# EAGLE schematic Esquemático v2 v50 (EAGLE 9.7.0)
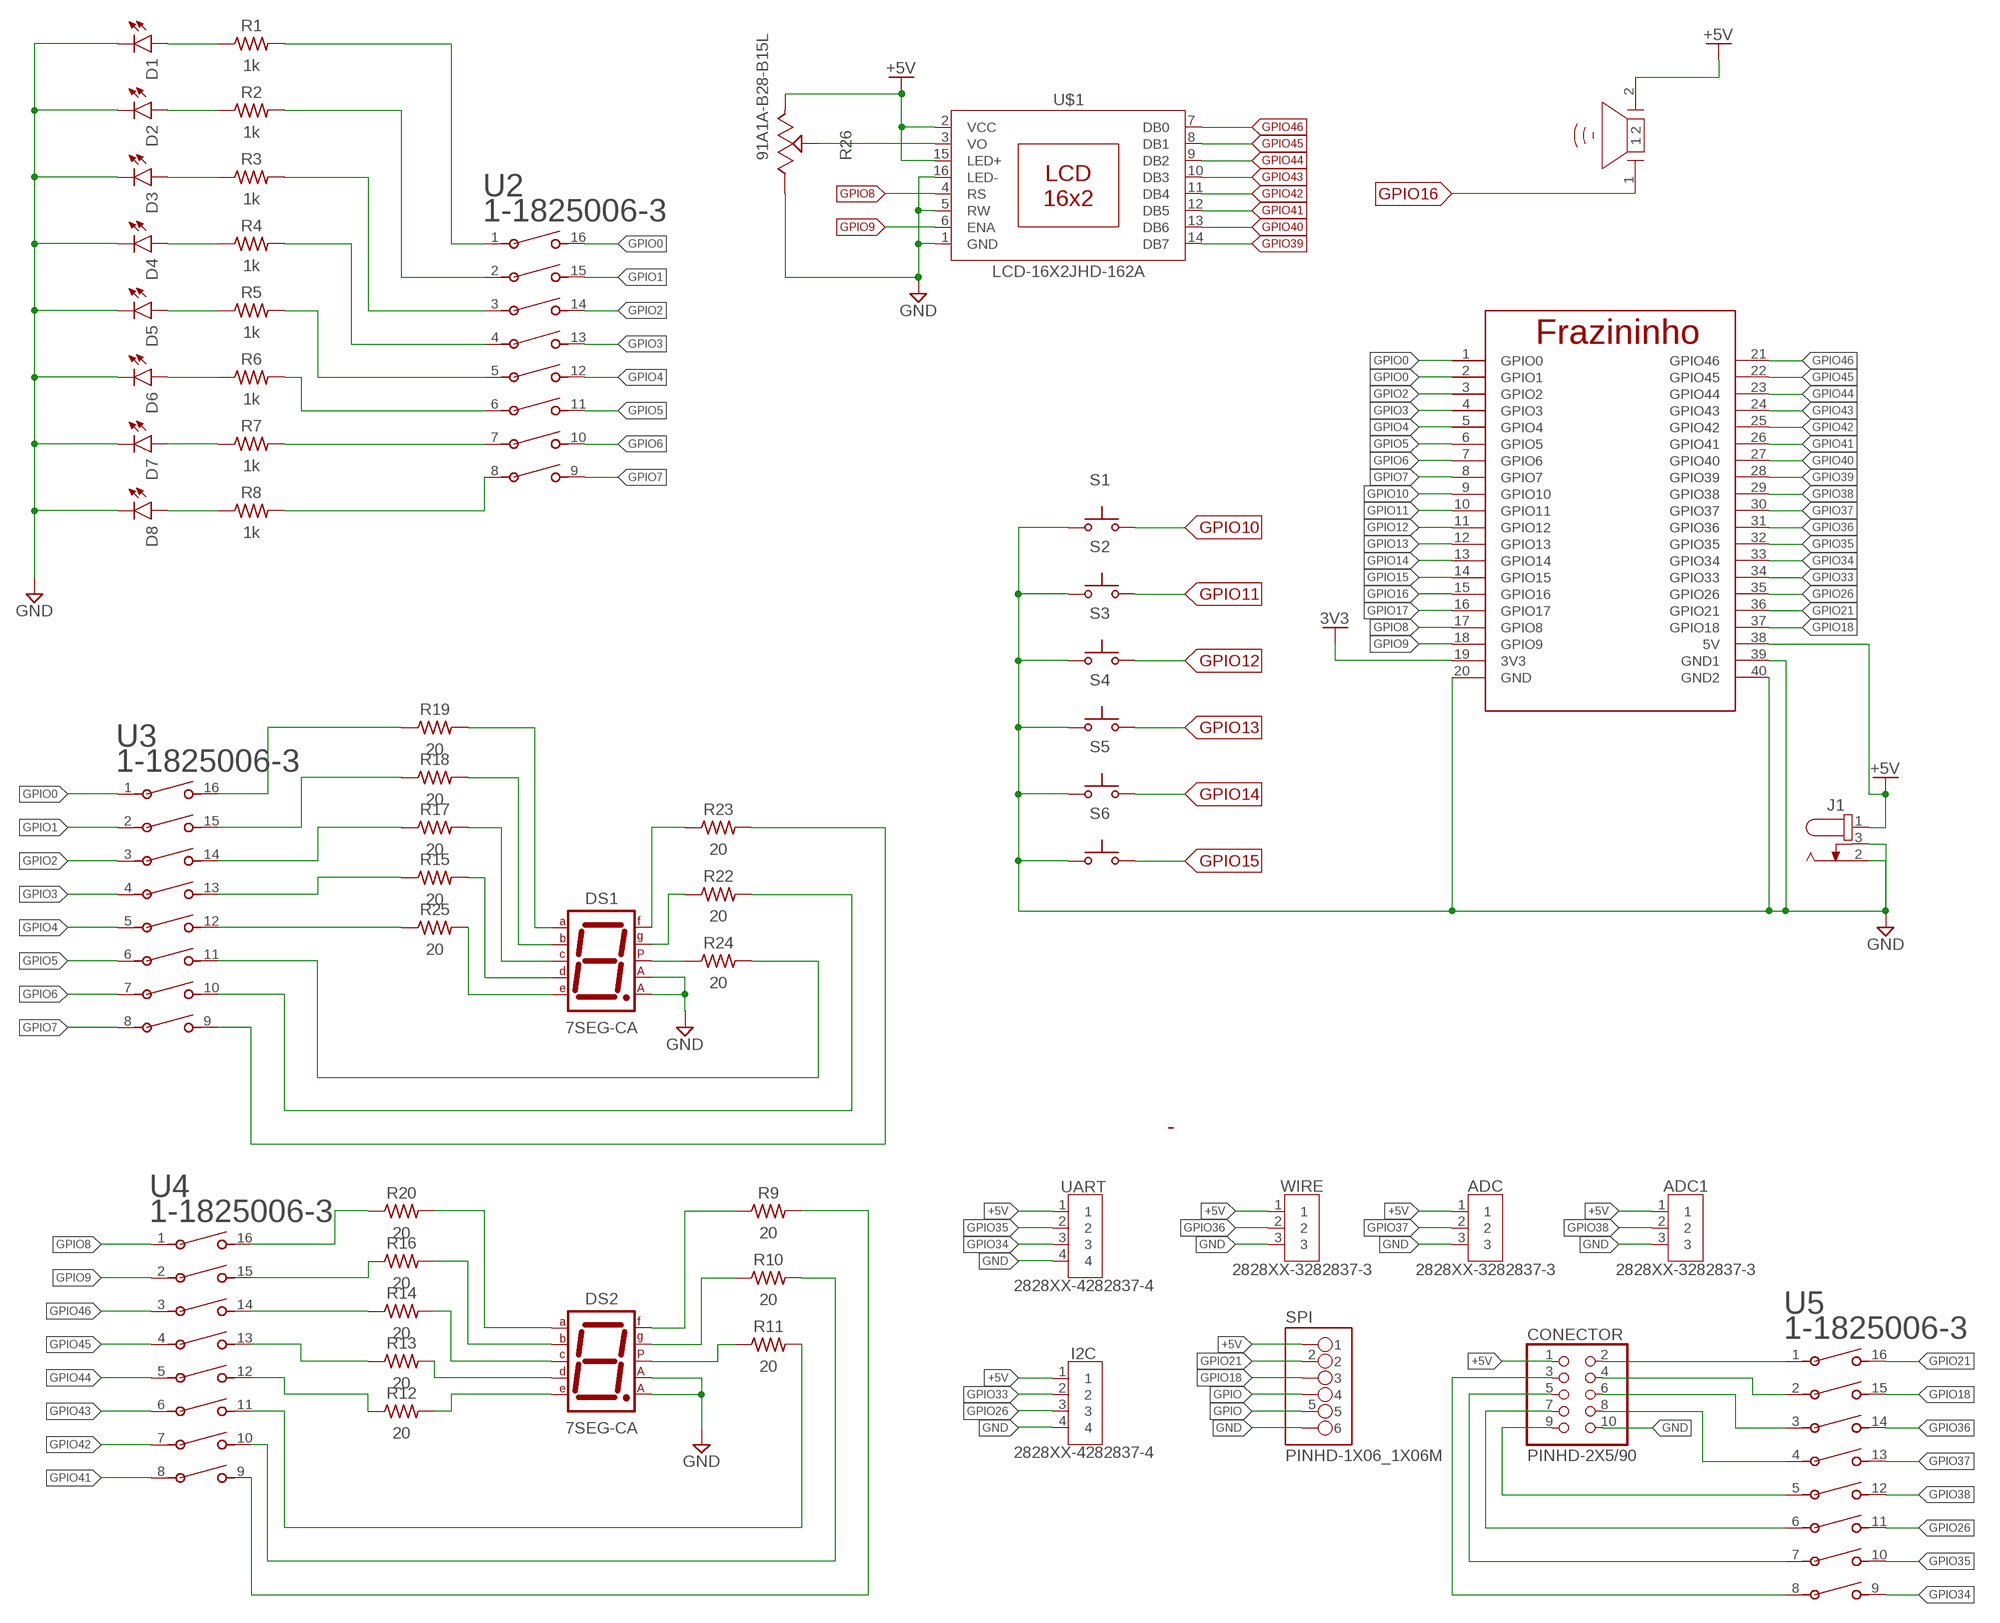
[diagram p0: schematic, sheet 1]

## Parts
ADC  2828XX-3282837-3  [TERMBLK_508-3N]
ADC1  2828XX-3282837-3  [TERMBLK_508-3N]
CONECTOR  PINHD-2X5/90  [2X05/90]
D1  LED_RADIAL  [LEDRD254W60D565H860B_G]
D2  LED_RADIAL  [LEDRD254W60D565H860B_G]
D3  LED_RADIAL  [LEDRD254W60D565H860B_G]
D4  LED_RADIAL  [LEDRD254W60D565H860B_G]
D5  LED_RADIAL  [LEDRD254W60D565H860B_G]
D6  LED_RADIAL  [LEDRD254W60D565H860B_G]
D7  LED_RADIAL  [LEDRD254W60D565H860B_G]
D8  LED_RADIAL  [LEDRD254W60D565H860B_G]
DS1  7SEG-CA  [7SEG-13]
DS2  7SEG-CA  [7SEG-13]
I2C  2828XX-4282837-4  [TERMBLK_508-4N]
J1  694106402002  [694106402002]
LS1  PIEZO  [PIEZO]
R1  1k  R-US_AXIAL-11.7MM-PITCH  [RESAD1176W63L850D250B]
R2  1k  R-US_AXIAL-11.7MM-PITCH  [RESAD1176W63L850D250B]
R3  1k  R-US_AXIAL-11.7MM-PITCH  [RESAD1176W63L850D250B]
R4  1k  R-US_AXIAL-11.7MM-PITCH  [RESAD1176W63L850D250B]
R5  1k  R-US_AXIAL-11.7MM-PITCH  [RESAD1176W63L850D250B]
R6  1k  R-US_AXIAL-11.7MM-PITCH  [RESAD1176W63L850D250B]
R7  1k  R-US_AXIAL-11.7MM-PITCH  [RESAD1176W63L850D250B]
R8  1k  R-US_AXIAL-11.7MM-PITCH  [RESAD1176W63L850D250B]
R9  20  R-US_AXIAL-11.7MM-PITCH  [RESAD1176W63L850D250B]
R10  20  R-US_AXIAL-11.7MM-PITCH  [RESAD1176W63L850D250B]
R11  20  R-US_AXIAL-11.7MM-PITCH  [RESAD1176W63L850D250B]
R12  20  R-US_AXIAL-11.7MM-PITCH  [RESAD1176W63L850D250B]
R13  20  R-US_AXIAL-11.7MM-PITCH  [RESAD1176W63L850D250B]
R14  20  R-US_AXIAL-11.7MM-PITCH  [RESAD1176W63L850D250B]
R15  20  R-US_AXIAL-11.7MM-PITCH  [RESAD1176W63L850D250B]
R16  20  R-US_AXIAL-11.7MM-PITCH  [RESAD1176W63L850D250B]
R17  20  R-US_AXIAL-11.7MM-PITCH  [RESAD1176W63L850D250B]
R18  20  R-US_AXIAL-11.7MM-PITCH  [RESAD1176W63L850D250B]
R19  20  R-US_AXIAL-11.7MM-PITCH  [RESAD1176W63L850D250B]
R20  20  R-US_AXIAL-11.7MM-PITCH  [RESAD1176W63L850D250B]
R22  20  R-US_AXIAL-11.7MM-PITCH  [RESAD1176W63L850D250B]
R23  20  R-US_AXIAL-11.7MM-PITCH  [RESAD1176W63L850D250B]
R24  20  R-US_AXIAL-11.7MM-PITCH  [RESAD1176W63L850D250B]
R25  20  R-US_AXIAL-11.7MM-PITCH  [RESAD1176W63L850D250B]
R26  91A1A-B28-B15L  [91A1A-B28-B15L-ND]
S1  SWITCH-OMRON_B3U-1000P  [SWITCH-OMRON_B3U-1000P]
S2  SWITCH-OMRON_B3U-1000P  [SWITCH-OMRON_B3U-1000P]
S3  SWITCH-OMRON_B3U-1000P  [SWITCH-OMRON_B3U-1000P]
S4  SWITCH-OMRON_B3U-1000P  [SWITCH-OMRON_B3U-1000P]
S5  SWITCH-OMRON_B3U-1000P  [SWITCH-OMRON_B3U-1000P]
S6  SWITCH-OMRON_B3U-1000P  [SWITCH-OMRON_B3U-1000P]
SPI  PINHD-1X06_1X06M  [1X06]
U1  FRANZININHO  [FRANZININHO]
U2  1-1825006-3  [SWDIP16_299X110P100]
U3  1-1825006-3  [SWDIP16_299X110P100]
U4  1-1825006-3  [SWDIP16_299X110P100]
U5  1-1825006-3  [SWDIP16_299X110P100]
U$1  LCD-16X2JHD-162A  [JHD-162A]
UART  2828XX-4282837-4  [TERMBLK_508-4N]
WIRE  2828XX-3282837-3  [TERMBLK_508-3N]

## Nets
3V3: U1.19(3V3)
+5V: ADC1.1 ADC.1 CONECTOR.1 I2C.1 J1.1 LS1.2 R26.1 SPI.1 U1.38(5V) U$1.2(VCC) U$1.15(LED+) UART.1 WIRE.1
GND: ADC1.3 ADC.3 CONECTOR.10 D1.2(C) D2.2(C) D3.2(C) D4.2(C) D5.2(C) D6.2(C) D7.2(C) D8.2(C) DS1.3(CA1) DS1.8(CA2) DS2.3(CA1) DS2.8(CA2) I2C.4 J1.2 J1.3 R26.3 S1.P$1(P) S2.P$1(P) S3.P$1(P) S4.P$1(P) S5.P$1(P) S6.P$1(P) SPI.6 U1.20(GND) U1.39(GND1) U1.40(GND2) U$1.1(GND) U$1.5(RW) U$1.16(LED-) UART.4 WIRE.3
GPIO: SPI.4 SPI.5
GPIO0: U1.1(GPIO0) U1.2(GPIO1) U2.16 U3.1
GPIO1: U2.15 U3.2
GPIO2: U1.3(GPIO2) U2.14 U3.3
GPIO3: U1.4(GPIO3) U2.13 U3.4
GPIO4: U1.5(GPIO4) U2.12 U3.5
GPIO5: U1.6(GPIO5) U2.11 U3.6
GPIO6: U1.7(GPIO6) U2.10 U3.7
GPIO7: U1.8(GPIO7) U2.9 U3.8
GPIO8: U1.17(GPIO8) U4.1 U$1.4(RS)
GPIO9: U1.18(GPIO9) U4.2 U$1.6(ENA)
GPIO10: R19.1 S1.P$3(S) U1.9(GPIO10) U3.16
GPIO11: R18.1 S2.P$3(S) U1.10(GPIO11) U3.15
GPIO12: R17.1 S3.P$3(S) U1.11(GPIO12) U3.14
GPIO13: R15.1 S4.P$3(S) U1.12(GPIO13) U3.13
GPIO14: R25.1 S5.P$3(S) U1.13(GPIO14) U3.12
GPIO15: R23.2 S6.P$3(S) U1.14(GPIO15) U3.9
GPIO16: LS1.1 R22.2 U1.15(GPIO16) U3.10
GPIO17: R24.2 U1.16(GPIO17) U3.11
GPIO18: SPI.3 U1.37(GPIO18) U5.15
GPIO21: SPI.2 U1.36(GPIO21) U5.16
GPIO26: I2C.3 U1.35(GPIO26) U5.11
GPIO33: I2C.2 U1.34(GPIO33)
GPIO34: U1.33(GPIO34) U5.9 UART.3
GPIO35: U1.32(GPIO35) U5.10 UART.2
GPIO36: U1.31(GPIO36) U5.14 WIRE.2
GPIO37: ADC.2 U1.30(GPIO37) U5.13
GPIO38: ADC1.2 U1.29(GPIO38) U5.12
GPIO39: U1.28(GPIO39) U$1.14(DB7)
GPIO40: U1.27(GPIO40) U$1.13(DB6)
GPIO41: U1.26(GPIO41) U4.8 U$1.12(DB5)
GPIO42: U1.25(GPIO42) U4.7 U$1.11(DB4)
GPIO43: U1.24(GPIO43) U4.6 U$1.10(DB3)
GPIO44: U1.23(GPIO44) U4.5 U$1.9(DB2)
GPIO45: U1.22(GPIO45) U4.4 U$1.8(DB1)
GPIO46: U1.21(GPIO46) U4.3 U$1.7(DB0)
N$1: D1.1(A) R1.1
N$2: D2.1(A) R2.1
N$3: D3.1(A) R3.1
N$4: D4.1(A) R4.1
N$5: D5.1(A) R5.1
N$6: D6.1(A) R6.1
N$7: D7.1(A) R7.1
N$8: D8.1(A) R8.1
N$9: DS2.7(A) R20.2
N$10: DS2.6(B) R16.2
N$11: DS2.4(C) R14.2
N$12: DS2.2(D) R13.2
N$13: DS2.1(E) R12.2
N$14: DS2.9(F) R9.1
N$15: DS2.10(G) R10.1
N$16: DS1.1(E) R25.2
N$17: DS1.2(D) R15.2
N$18: DS1.4(C) R17.2
N$19: DS1.6(B) R18.2
N$20: DS1.7(A) R19.2
N$21: DS1.10(G) R22.1
N$22: DS1.9(F) R23.1
N$23: DS1.5(DP) R24.1
N$24: R26.2 U$1.3(VO)
N$25: R1.2 U2.1
N$26: R5.2 U2.5
N$27: R6.2 U2.6
N$28: R7.2 U2.7
N$29: R8.2 U2.8
N$30: R4.2 U2.4
N$31: R3.2 U2.3
N$32: R2.2 U2.2
N$33: DS2.5(DP) R11.1
N$34: R20.1 U4.16
N$35: R16.1 U4.15
N$36: R14.1 U4.14
N$37: R13.1 U4.13
N$38: R12.1 U4.12
N$39: R11.2 U4.11
N$40: R10.2 U4.10
N$41: R9.2 U4.9
N$49: CONECTOR.3 U5.8
N$50: CONECTOR.5 U5.7
N$51: CONECTOR.7 U5.6
N$52: CONECTOR.9 U5.5
N$53: CONECTOR.2 U5.1
N$54: CONECTOR.4 U5.2
N$55: CONECTOR.6 U5.3
N$56: CONECTOR.8 U5.4

## Library data of the parts
ADC ADC1 WIRE = Connector:2828XX-3: 3 Position Wire to Board Terminal Block Horizontal with Board Datasheet <https://www.te.com.cn/commerce/DocumentDelivery/DDEController?Action=showdoc&DocId=Catalog+Section%7F1308389_EUROSTYLE_TERMINAL_BLOCKS%7F0607%7Fpdf%7FEnglish%7FENG_CS_1308389_EUROSTYLE_TERMINAL_BLOCKS_0607.pdf%7F2-282837-5>; CATEGORY: Connector; DESCRIPTION: TERM BLK 3P SIDE ENT 5.08mm PCB; MANUFACTURER: TE Connectivity; MPN: 282837-3; OPERATING_TEMPERATURE: -40°C to +105°C; PART_STATUS: Active; ROHS_COMPLIANCE: RoHS Compliant; SERIES: 282837; SUBCATEGORY: Terminal Block; TYPE: Side Wire Entry
CONECTOR = Connector:PINHD-2X5: PIN HEADER; CATEGORY: CONNECTOR; SUB-CATEGORY: PIN-HEADER
D1-D8 = Library:LED_RADIAL: LED - Generic
DS1 DS2 = Opto-Electronic:7SEG-CA: 7-segment DISPLAY single anode, 13 mm; CATEGORY: Opto-Electronic; SUB-CATEGORY: Display; TYPE: 7-Segment
I2C UART = Connector:2828XX-4: 4 Position Wire to Board Terminal Block Horizontal with Board Datasheet <https://www.te.com.cn/commerce/DocumentDelivery/DDEController?Action=showdoc&DocId=Catalog+Section%7F1308389_EUROSTYLE_TERMINAL_BLOCKS%7F0607%7Fpdf%7FEnglish%7FENG_CS_1308389_EUROSTYLE_TERMINAL_BLOCKS_0607.pdf%7F2-282837-5>; CATEGORY: Connector; DESCRIPTION: TERM BLK 4P SIDE ENT 5.08mm PCB; MANUFACTURER: TE Connectivity; MPN: 282837-4; OPERATING_TEMPERATURE: 40°C to +105°C; PART_STATUS: Active; ROHS_COMPLIANCE: RoHS Compliant; SERIES: 283737; SUBCATEGORY: Terminal Block; TYPE: Side Wire Entry
J1 = Connector:694106402002: DC POWER JACK - VERTICAL - THT - 2.0 & 2.5Ø - WR-DC Details see: Datasheet <https://katalog.we-online.com/en/em/DC_THT_VERTICAL_6_4_69410X402002>; CATEGORY: Connector; DESCRIPTION: DC POWER JACK - VERTICAL - THT - 2.0 & 2.5Ø - WR-DC; MANUFACTURER: Würth Elektronik; MPN: 694106402002; OPERATING_TEMPERATURE: -40°C to +85°C; PART_STATUS: Active; ROHS_COMPLIANCE: RoHS Compliant; SERIES: WR-DC; SUBCATEGORY: Power Connector; TYPE: Vertical
LS1 = Tinkercad:PIEZO: Piezoelectric Sounders / Buzzers Reference Datasheet <https://www.murata.com/products/productdata/8801054621726/SPEC-PKM17EPPH4001-B0.pdf?1517839212000>
R1-R20 R22-R25 = Resistor:R-US: Resistor Fixed - ANSI; CATEGORY: Resistor; SUB-CATEGORY: Fixed
R26 = Potentiometer_Trimmers:91A1A-B28-B15L: POT 10K OHM 1W PLASTIC LINEAR Manufacturer's datasheet <https://www.bourns.com/docs/Product-Datasheets/91_95.pdf>; CREATED_BY: PCBLayout.com; DIGIKEY_PARTNO: 91A1A-B28-B15L-ND; MANUFACTURER: Bourns Inc.; MPN: 91A1A-B28-B15L
S1-S6 = 52101-101-REV-A_v16:SWITCH-OMRON_B3U-1000P: SMD Tactile Switch - Ultra Small
SPI = Tinkercad:PINHD-1X06
U1 = LIB Franzininho:FRANZININHO: Espressif ESP32 WiFi-compatible SoC microcontroller. Bluetooth Low energy support (BLE, BT4.0, Bluetooth Smart) 28 GPIO pins Dual-core Tensilica LX6 microprocessor Hardware accelerated encryption (AES, SHA2, ECC, RSA-4096) 4MB Flash memory 520kB internal SRAM Datasheet <https://cdn.sparkfun.com/datasheets/IoT/esp32_datasheet_en.pdf> SparkFun Products: SparkFun ESP32 Thing <https://www.sparkfun.com/products/13907>; PROD_ID: IC-13338
U2-U5 = Switches:1-1825006-3; BUILT_BY: EMA_UL_Team; CATEGORY: DIP & SIP Switches; COPYRIGHT: Copyright (C) 2016 Accelerated Designs. All rights reserved; DESCRIPTION: GDS0804=DIP SW,SLIDE,THRU/HL; MANUFACTURER_PART_NUMBER: 1-1825006-3; PART_STATUS: active; SERIES: Alcoswitch DIP,Alcoswitch DIP GDS; VENDOR: TE Connectivity
U$1 = Tinkercad:LCD-16X2